# EasyEDA schematic CircuitScheme_CraneCorp.json
TITLE: CIRCUIT SCHEME; REV: 1.0; Date: 2024-05-30; Sheet: 1/1; Drawn By: ayan.furkan; Company: CRANECORP
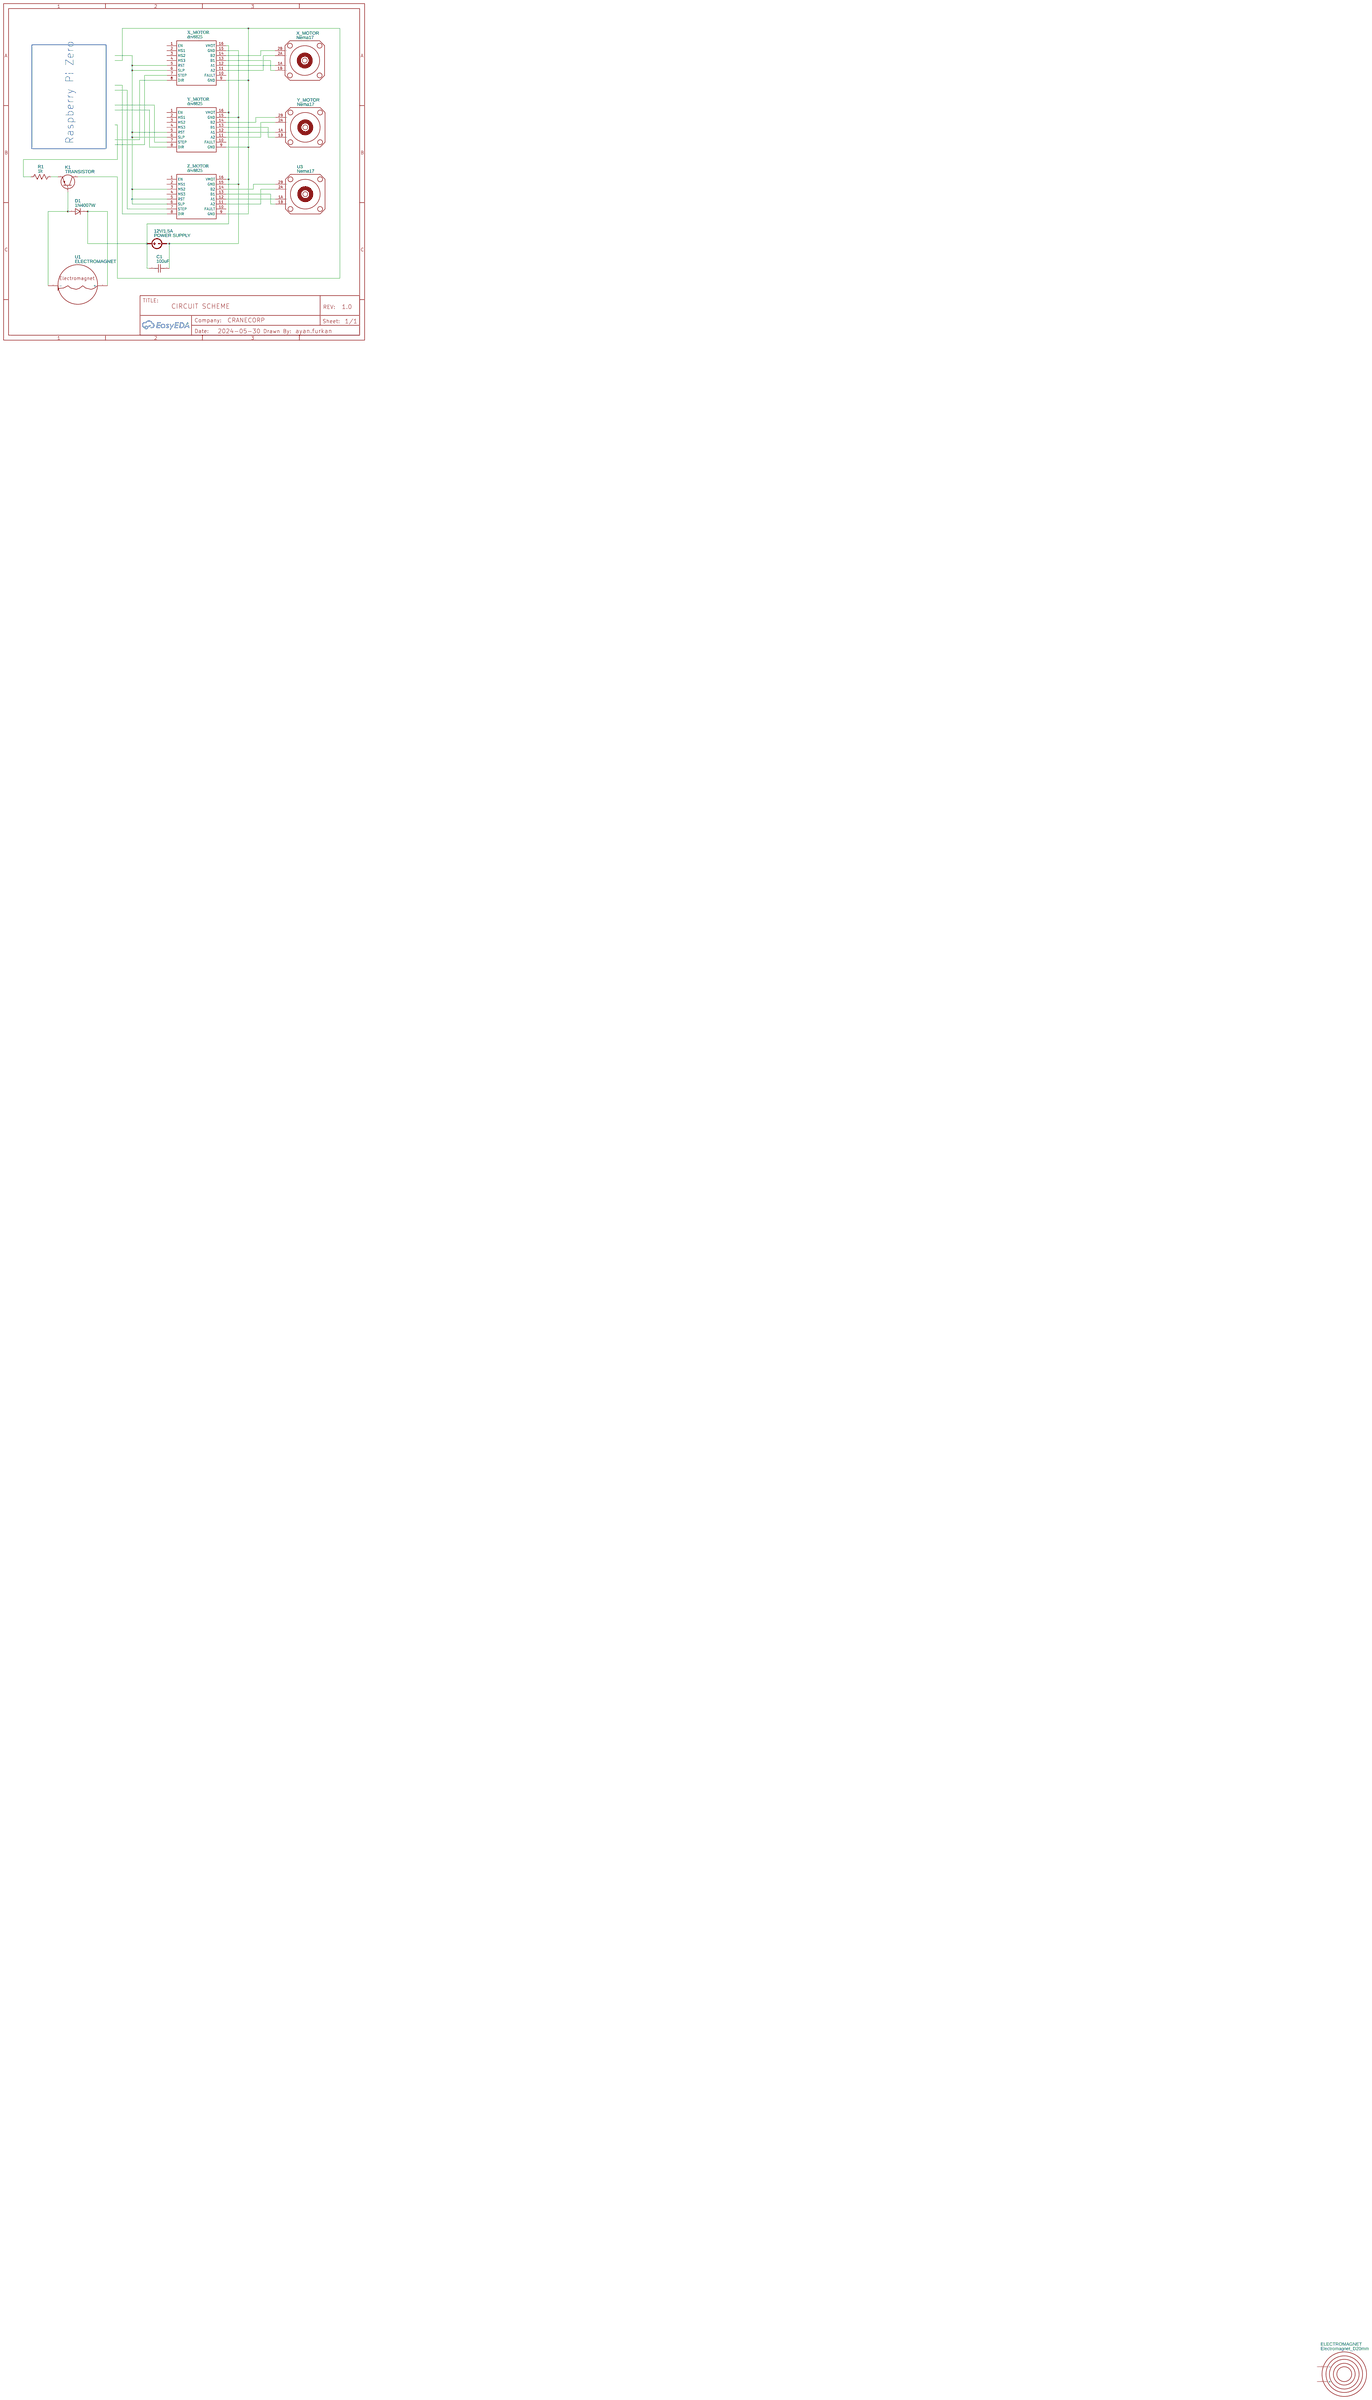
[diagram p0: schematic sheet]

## Parts
12V/1.5A  POWER SUPPLY
C1  100uF  [C0603]
D1  1N4007W  [SOD-123_L2.8-W1.8-LS3.7-RD]
ELECTROMAGNET  Electromagnet_D20mm  [ELECTROMAGNET_D20MM]
K1  TRANSISTOR  [PNP-TRANSISTOR]
R1  1k  [R0603]
U1  ELECTROMAGNET  [88LB ELECTROMAGNET]
U3  Nema17  [NEMA17]
X_MOTOR  drv8825
X_MOTOR#2  Nema17  [NEMA17]
Y_MOTOR  drv8825
Y_MOTOR#2  Nema17  [NEMA17]
Z_MOTOR  drv8825

## Library data of the parts
12V/1.5A = PowerSupply12V: catid: 20; Contributor: drukarkigorniczowa; sim: true
C1 = C_0603_US: Contributor: LCEDA_Lib
D1 = 1N4007W: Supplier: LCSC; Supplier Part: C328592; Manufacturer: BLUE ROCKET; Contributor: LCEDA_Lib
ELECTROMAGNET = Electromagnet_D20mm: Contributor: madhunm
K1 = PNP-TRANSISTOR: Contributor: Happy23
R1 = R_0603_US: Contributor: LCEDA_Lib
U1 = 88lb eLECTRO mAGNET: link: https://www.ebay.com/itm/DC-12V-88-LB-40kg-Electric-Lifting-Electromagnet-Magnet-Solenoid-Holding/322937691481; Contributor: theofficialdibbles
U3 X_MOTOR#2 Y_MOTOR#2 = Nema17: Contributor: zaiets_ak20

## Nets
Net-(C1-1): C1.1 X_MOTOR.15(GND) Y_MOTOR.15(GND) Z_MOTOR.15(GND)
Net-(C1-2): C1.2 D1.1 U1.2(+) X_MOTOR.16(VMOT) Y_MOTOR.16(VMOT) Z_MOTOR.16(VMOT)
Net-(D1-2): D1.2 K1.B U1.1(-)
Net-(K1-C): K1.C X_MOTOR.9(GND) Y_MOTOR.9(GND) Z_MOTOR.9(GND)
Net-(K1-E): K1.E R1.2
Net-(U3-1A): U3.1A(A) Z_MOTOR.12(A1)
Net-(U3-1B): U3.1B(B) Z_MOTOR.13(B1)
Net-(U3-2A): U3.2A(A) Z_MOTOR.11(A2)
Net-(U3-2B): U3.2B(B) Z_MOTOR.14(B2)
Net-(X_MOTOR-5): X_MOTOR.5(RST) X_MOTOR.6(SLP) Y_MOTOR.5(RST) Y_MOTOR.6(SLP) Z_MOTOR.3(MS2) Z_MOTOR.5(RST) Z_MOTOR.6(SLP)
Net-(X_MOTOR-11): X_MOTOR.11(A2) X_MOTOR#2.2A(A)
Net-(X_MOTOR-12): X_MOTOR.12(A1) X_MOTOR#2.1A(A)
Net-(X_MOTOR-13): X_MOTOR.13(B1) X_MOTOR#2.1B(B)
Net-(X_MOTOR-14): X_MOTOR.14(B2) X_MOTOR#2.2B(B)
Net-(Y_MOTOR-11): Y_MOTOR.11(A2) Y_MOTOR#2.2A(A)
Net-(Y_MOTOR-12): Y_MOTOR.12(A1) Y_MOTOR#2.1A(A)
Net-(Y_MOTOR-13): Y_MOTOR.13(B1) Y_MOTOR#2.1B(B)
Net-(Y_MOTOR-14): Y_MOTOR.14(B2) Y_MOTOR#2.2B(B)

Not connected (* = marked no-connect by the designer): ELECTROMAGNET 1(+) 2(-); R1 1; X_MOTOR 1(EN) 2(MS1) 3(MS2) 4(MS3) 7(STEP) 8(DIR) 10(FAULT); Y_MOTOR 1(EN) 2(MS1) 3(MS2) 4(MS3) 7(STEP) 8(DIR) 10(FAULT); Z_MOTOR 1(EN) 2(MS1) 4(MS3) 7(STEP) 8(DIR) 10(FAULT)

## Notes on the sheet
- Raspberry Pi Zero
